# EAGLE schematic main (EAGLE 9.2.2)
Assembly variants: co

## Sheet 1 of 8: PSU
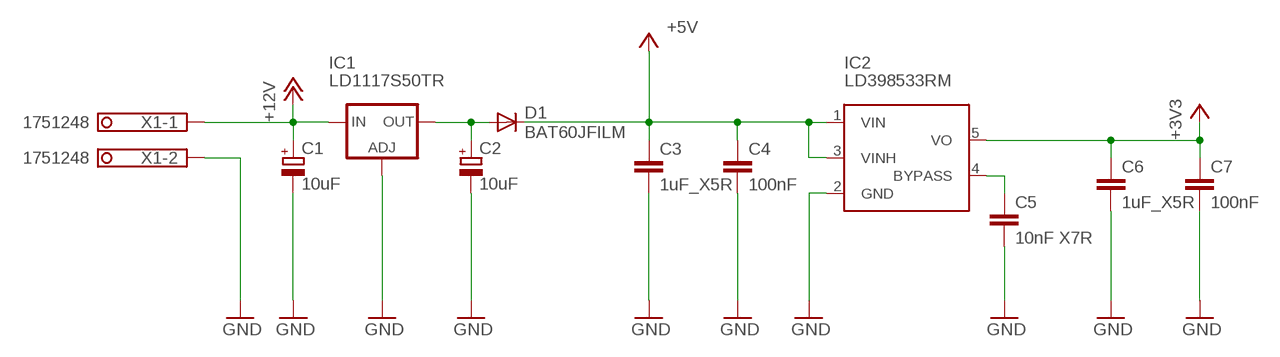
[diagram p0: schematic, sheet 1]

### Parts
C1  10uF  CPOL-EUSMCC  [SMC_C]
C2  10uF  CPOL-EUSMCC  [SMC_C]
C3  1uF_X5R  C-EUC0805  [C0805]
C4  100nF  C-EUC0805  [C0805]
C5  10nF X7R  C-EUC0805  [C0805]
C6  1uF_X5R  C-EUC0805  [C0805]
C7  100nF  C-EUC0805  [C0805]
D1  BAT60JFILM  DIODE-SOD323-W  [SOD323-W]
IC1  LD1117S50TR  LD117AS50TR  [SOT223]
IC2  LD398533RM  [SOT23-5L]
X1  1751248  [1751248]

### Nets
+3V3: C6.1 C7.1 IC2.5(VO) ; also sheet 2,3,4,5,6
+5V: C3.1 C4.1 D1.C IC2.1(VIN) IC2.3(VINH) ; also sheet 2,3,6
+12V [pwr]: C1.+ IC1.3(IN) X1.1 ; also sheet 7
GND [gnd]: C1.- C2.- C3.2 C4.2 C5.2 C6.2 C7.2 IC1.1(ADJ) IC2.2(GND) X1.2 ; also sheet 2,3,4,5,6,7
N$23: C2.+ D1.A IC1.4(OUT)
N$102: C5.1 IC2.4(BYPASS)

## Sheet 2 of 8: MCU
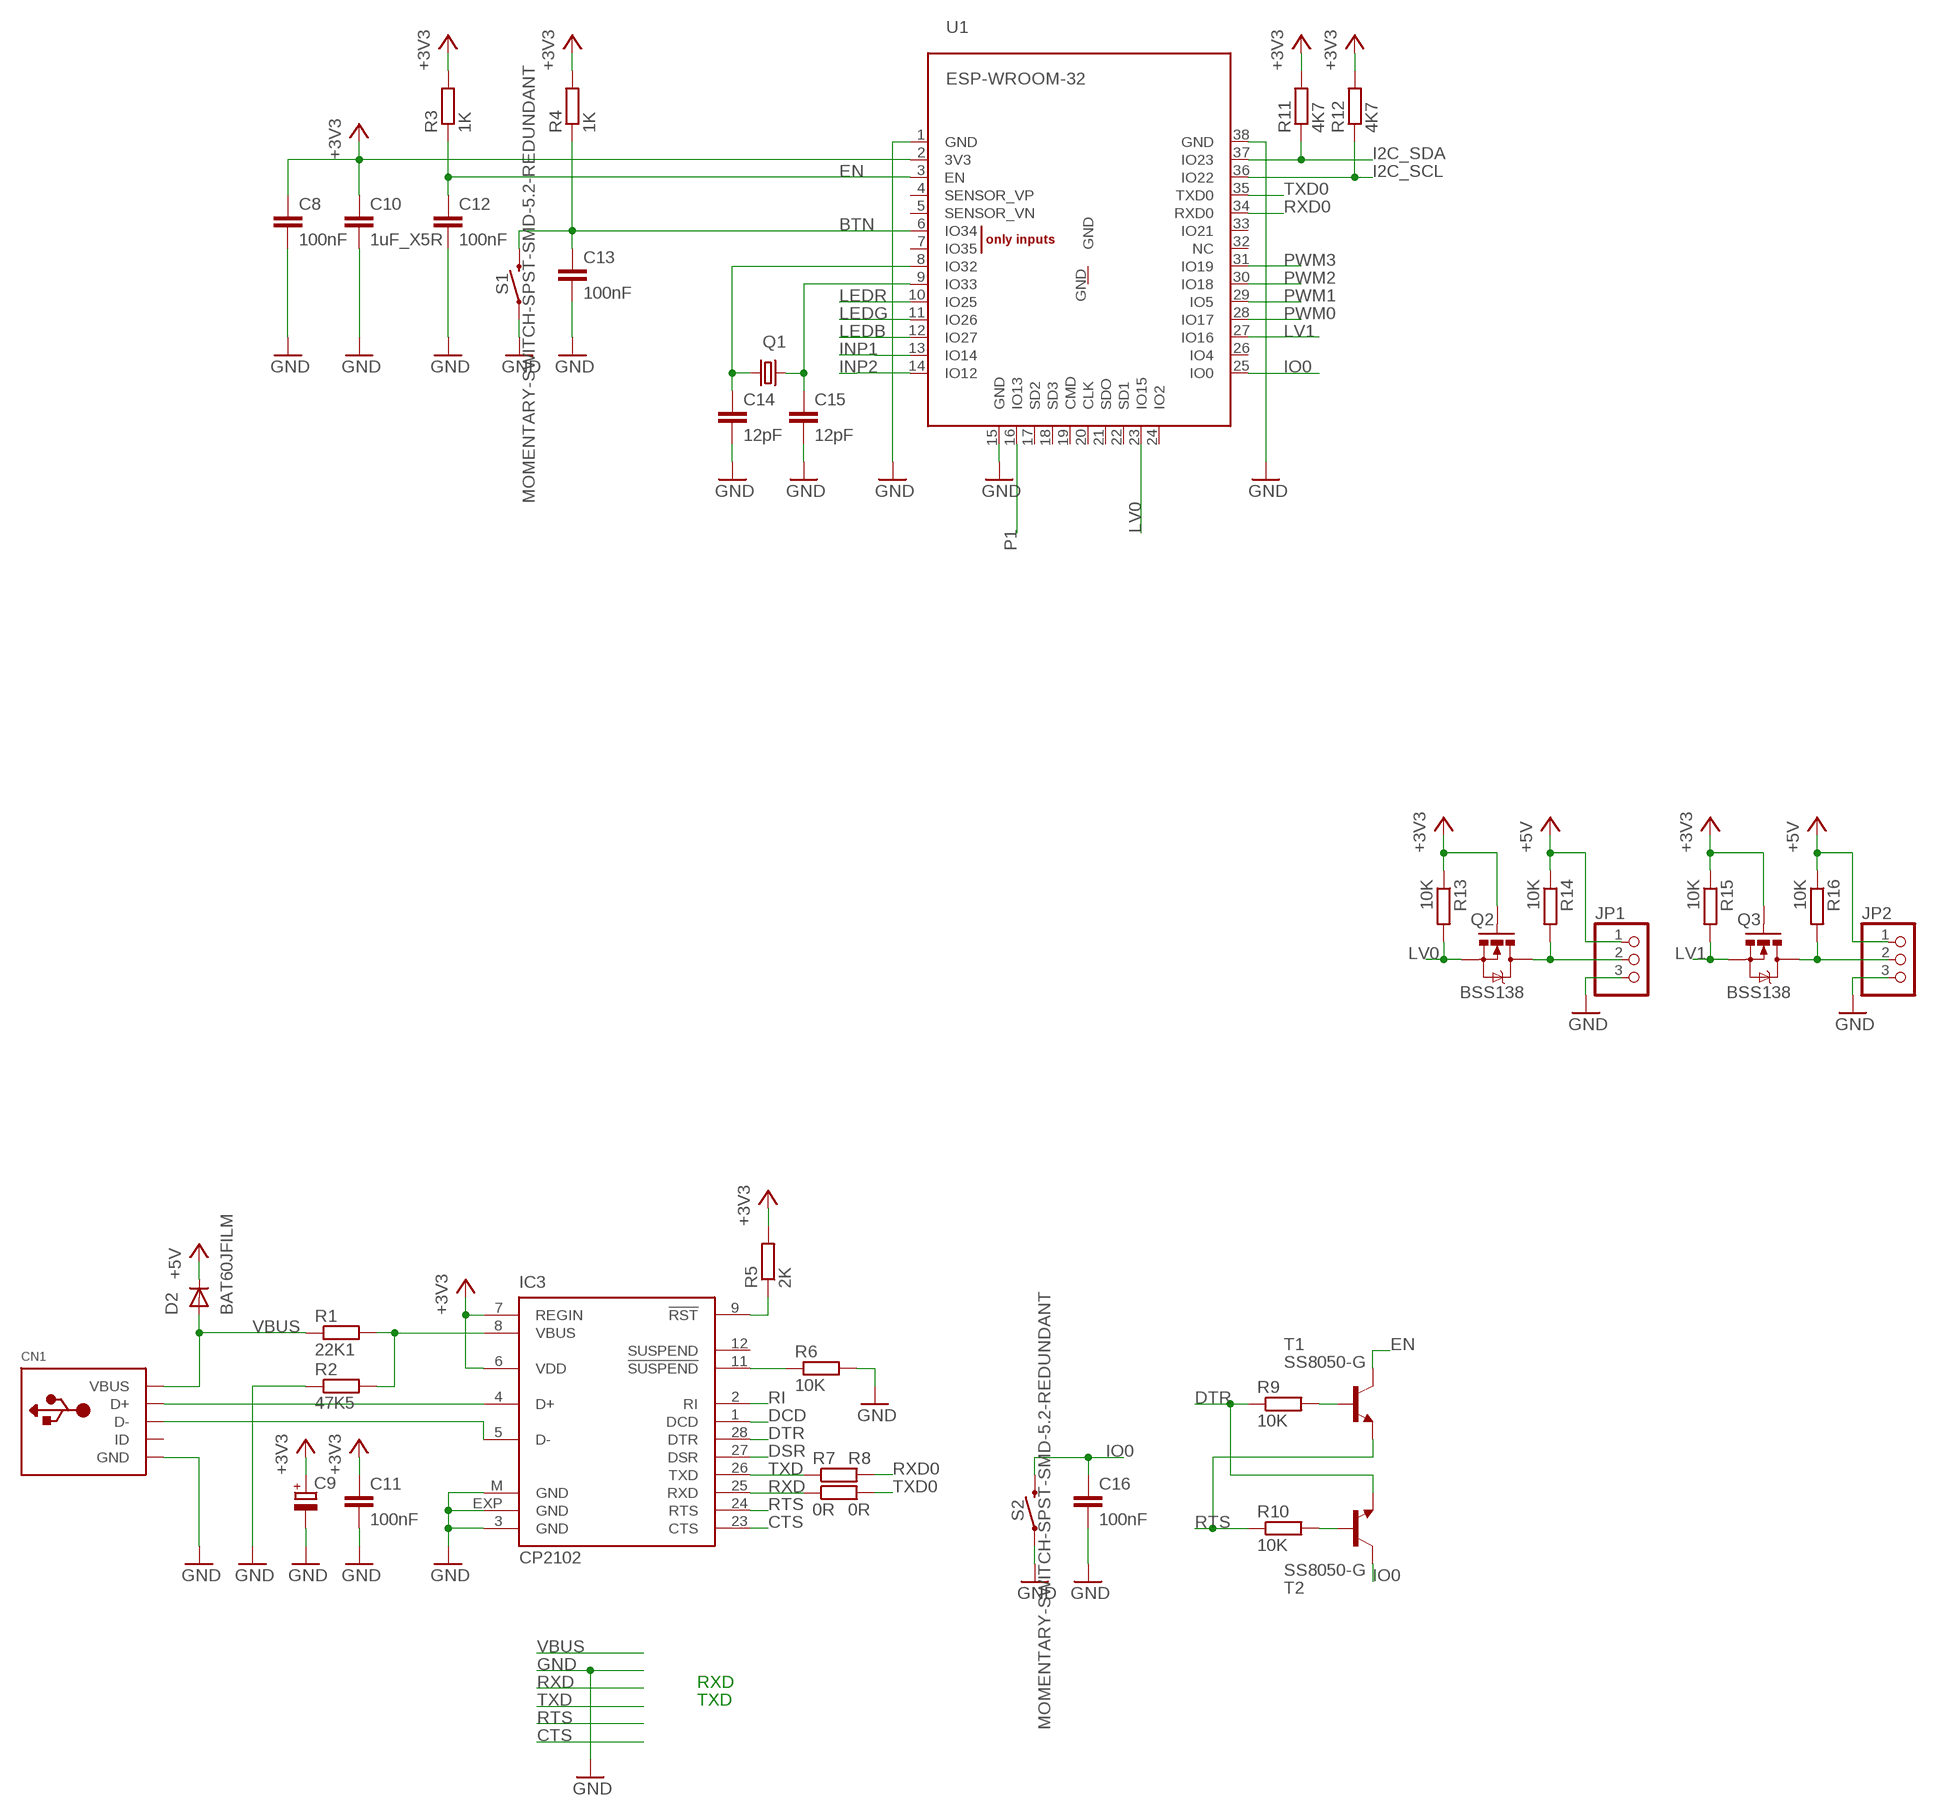
[diagram p1: schematic, sheet 2]

### Parts
C8  100nF  C-EUC0805  [C0805]
C9  CPOL-EUSMCA  [SMC_A]
C10  1uF_X5R  C-EUC0805  [C0805]
C11  100nF  C-EUC0805  [C0805]
C12  100nF  C-EUC0805  [C0805]
C13  100nF  C-EUC0805  [C0805]
C14  12pF  C-EUC0805  [C0805]
C15  12pF  C-EUC0805  [C0805]
C16  100nF  C-EUC0805  [C0805]
CN1  USBMINIB  [USB-MINIB]
D2  BAT60JFILM  DIODE-SOD323-W  [SOD323-W]
IC3  CP2102  [MLP28]
JP1  PINHD-1X3  [1X03]
JP2  PINHD-1X3  [1X03]
Q1  CRYSTALTC38H  [TC38H]
Q2  BSS138  MOSFET-NCHANNELSMD  [SOT23-3]
Q3  BSS138  MOSFET-NCHANNELSMD  [SOT23-3]
R1  22K1  R-EU_R0805  [R0805]
R2  47K5  R-EU_R0805  [R0805]
R3  1K  R-EU_R0805  [R0805]
R4  1K  R-EU_R0805  [R0805]
R5  2K  R-EU_R0805  [R0805]
R6  10K  R-EU_R0805  [R0805]
R7  0R  R-EU_R0805  [R0805]
R8  0R  R-EU_R0805  [R0805]
R9  10K  R-EU_R0805  [R0805]
R10  10K  R-EU_R0805  [R0805]
R11  4K7  R-EU_R0805  [R0805]
R12  4K7  R-EU_R0805  [R0805]
R13  10K  R-EU_R0805  [R0805]
R14  10K  R-EU_R0805  [R0805]
R15  10K  R-EU_R0805  [R0805]
R16  10K  R-EU_R0805  [R0805]
S1  MOMENTARY-SWITCH-SPST-SMD-5.2-REDUNDANT  [TACTILE_SWITCH_SMD_5.2MM]
S2  MOMENTARY-SWITCH-SPST-SMD-5.2-REDUNDANT  [TACTILE_SWITCH_SMD_5.2MM]
T1  SS8050-G  BCF29-NPN-SOT23-BEC  [SOT23-BEC]
T2  SS8050-G  BCF29-NPN-SOT23-BEC  [SOT23-BEC]
U1  ESP-WROOM-32  [ESP-WROOM-32]

### Nets
+3V3: C8.1 C9.+ C10.1 C11.1 IC3.6(VDD) IC3.7(REGIN) Q2.1(G) Q3.1(G) R3.2 R4.2 R5.2 R11.2 R12.2 R13.1 R15.1 U1.2(3V3) ; also sheet 1,3,4,5,6
+5V: D2.C JP1.1 JP2.1 R14.1 R16.1 ; also sheet 1,3,6
BTN: C13.1 R4.1 S1.3 S1.4 U1.6(IO34)
CTS: IC3.23(CTS)
DCD: IC3.1(DCD)
DSR: IC3.27(DSR)
DTR: IC3.28(DTR) R9.1 T2.E
EN: C12.1 R3.1 T1.C U1.3(EN)
GND [gnd]: C8.2 C9.- C10.2 C11.2 C12.2 C13.2 C14.2 C15.2 C16.2 CN1.GND IC3.3(GND) IC3.EXP(GND) IC3.M(GND) JP1.3 JP2.3 R2.1 R6.2 S1.1 S1.2 S2.1 S2.2 U1.1(GND) U1.15(GND) U1.38(GND) ; also sheet 1,3,4,5,6,7
HV1: JP1.2 Q2.3(D) R14.2
HV2: JP2.2 Q3.3(D) R16.2
I2C_SCL: R12.1 U1.36(IO22) ; also sheet 4
I2C_SDA: R11.1 U1.37(IO23) ; also sheet 4
INP1: U1.13(IO14) ; also sheet 3
INP2: U1.14(IO12) ; also sheet 3
IO0: C16.1 S2.3 S2.4 T2.C U1.25(IO0)
LEDB: U1.12(IO27) ; also sheet 5
LEDG: U1.11(IO26) ; also sheet 5
LEDR: U1.10(IO25) ; also sheet 5
LV0: Q2.2(S) R13.2 U1.23(IO15)
LV1: Q3.2(S) R15.2 U1.27(IO16)
N$6: CN1.D+ IC3.4(D+)
N$19: IC3.11(!SUSPEND) R6.1
N$21: IC3.9(!RST) R5.1
N$24: IC3.8(VBUS) R1.2 R2.2
N$25: CN1.D- IC3.5(D-)
N$38: C14.1 Q1.2 U1.8(IO32)
N$39: C15.1 Q1.1 U1.9(IO33)
N$42: R9.2 T1.B
N$43: R10.2 T2.B
P1: U1.16(IO13) ; also sheet 6
PWM0: U1.28(IO17) ; also sheet 7
PWM1: U1.29(IO5) ; also sheet 7
PWM2: U1.30(IO18) ; also sheet 7
PWM3: U1.31(IO19) ; also sheet 7
RI: IC3.2(RI)
RTS: IC3.24(RTS) R10.1 T1.E
RXD: IC3.25(RXD) R8.1
RXD0: R7.2 U1.34(RXD0)
TXD: IC3.26(TXD) R7.1
TXD0: R8.2 U1.35(TXD0)
VBUS: CN1.VBUS D2.A R1.1
Unconnected: CN1.ID IC3.12(SUSPEND) U1.4(SENSOR_VP) U1.5(SENSOR_VN) U1.7(IO35) U1.17(SD2) U1.18(SD3) U1.19(CMD) U1.20(CLK) U1.21(SDO) U1.22(SD1) U1.24(IO2) U1.26(IO4) U1.32(NC) U1.33(IO21) U1.GND

### Notes on the sheet
- RXD
- TXD

## Sheet 3 of 8: INPUTS
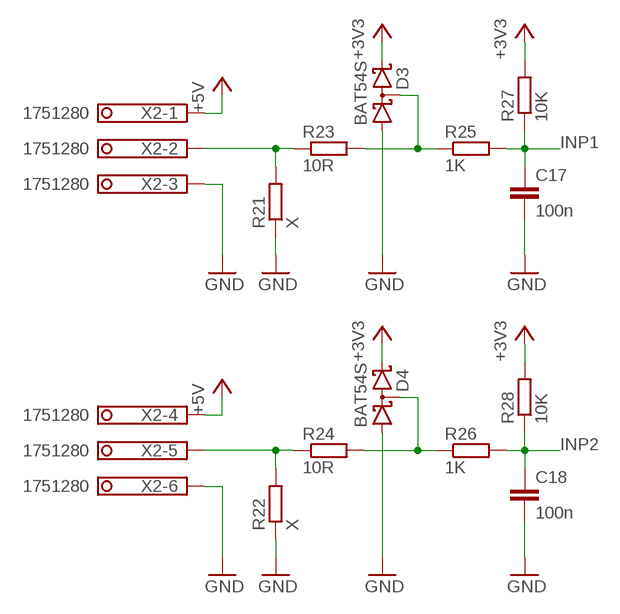
[diagram p2: schematic, sheet 3]

### Parts
C17  100n  C-EUC0805  [C0805]
C18  100n  C-EUC0805  [C0805]
D3  BAT54S  [SOT23]
D4  BAT54S  [SOT23]
R21  X  R-EU_R0805  [R0805]
R22  X  R-EU_R0805  [R0805]  (not fitted in variant co)
R23  10R  R-EU_R0805  [R0805]
R24  10R  R-EU_R0805  [R0805]
R25  1K  R-EU_R0805  [R0805]
R26  1K  R-EU_R0805  [R0805]
R27  10K  R-EU_R0805  [R0805]
R28  10K  R-EU_R0805  [R0805]
X2  1751280  [1751280]

### Nets
+3V3: D3.2(C2) D4.2(C2) R27.2 R28.2 ; also sheet 1,2,4,5,6
+5V: X2.1 X2.4 ; also sheet 1,2,6
GND [gnd]: C17.2 C18.2 D3.1(A1) D4.1(A1) R21.1 R22.1 X2.3 X2.6 ; also sheet 1,2,4,5,6,7
INP1: C17.1 R25.2 R27.1 ; also sheet 2
INP2: C18.1 R26.2 R28.1 ; also sheet 2
N$2: R22.2 R24.1 X2.5
N$3: D3.3(C1A2) R23.2 R25.1
N$8: D4.3(C1A2) R24.2 R26.1
N$20: R21.2 R23.1 X2.2

## Sheet 4 of 8: SENSOR
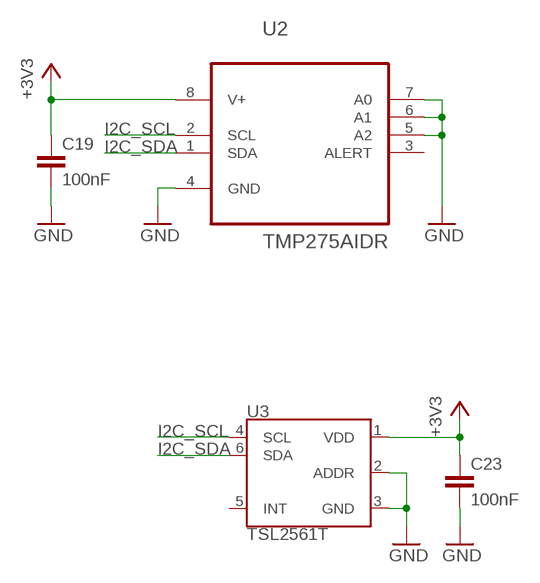
[diagram p3: schematic, sheet 4]

### Parts
C19  100nF  C-EUC0805  [C0805]
C23  100nF  C-EUC0805  [C0805]
U2  TMP275AIDR  [SOIC127P600X175-8N]
U3  TSL2561T  [TMB-6]

### Nets
+3V3: C19.1 C23.1 U2.8(V+) U3.1(VDD) ; also sheet 1,2,3,5,6
GND [gnd]: C19.2 C23.2 U2.4(GND) U2.5(A2) U2.6(A1) U2.7(A0) U3.2(ADDR) U3.3(GND) ; also sheet 1,2,3,5,6,7
I2C_SCL: U2.2(SCL) U3.4(SCL) ; also sheet 2
I2C_SDA: U2.1(SDA) U3.6(SDA) ; also sheet 2
Unconnected: U2.3(ALERT) U3.5(INT)

## Sheet 5 of 8: LED
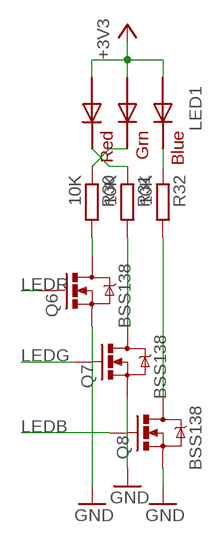
[diagram p4: schematic, sheet 5]

### Parts
LED1  RGBLED5050  [RGBLED5050]
Q6  BSS138  MOSFET-NCHANNELSMD  [SOT23-3]
Q7  BSS138  MOSFET-NCHANNELSMD  [SOT23-3]
Q8  BSS138  MOSFET-NCHANNELSMD  [SOT23-3]
R30  10K  R-EU_R0805  [R0805]
R31  10K  R-EU_R0805  [R0805]
R32  10K  R-EU_R0805  [R0805]

### Nets
+3V3: LED1.1(GREEN_A) LED1.2(RED_A) LED1.3(BLUE_A) ; also sheet 1,2,3,4,6
GND [gnd]: Q6.2(S) Q7.2(S) Q8.2(S) ; also sheet 1,2,3,4,6,7
LEDB: Q8.1(G) ; also sheet 2
LEDG: Q7.1(G) ; also sheet 2
LEDR: Q6.1(G) ; also sheet 2
N$1: Q6.3(D) R30.2
N$5: LED1.6(GREEN_C) R30.1
N$11: LED1.5(RED_C) R31.1
N$29: LED1.4(BLUE_C) R32.1
N$31: Q7.3(D) R31.2
N$32: Q8.3(D) R32.2

## Sheet 6 of 8: P1
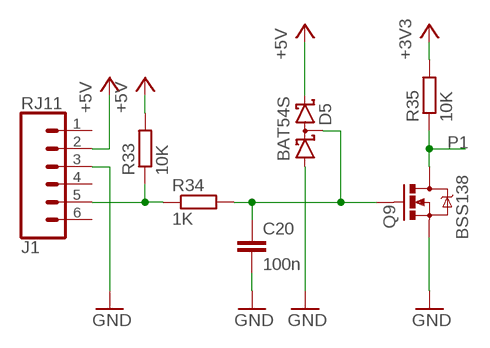
[diagram p5: schematic, sheet 6]

### Parts
C20  100n  C-EUC0805  [C0805]
D5  BAT54S  [SOT23]
J1  RJ11  RJ11-6  [RJ11-6]
Q9  BSS138  MOSFET-NCHANNELSMD  [SOT23-3]
R33  10K  R-EU_R0805  [R0805]
R34  1K  R-EU_R0805  [R0805]
R35  10K  R-EU_R0805  [R0805]

### Nets
+3V3: R35.2 ; also sheet 1,2,3,4,5
+5V: D5.2(C2) J1.2 R33.2 ; also sheet 1,2,3
GND [gnd]: C20.2 D5.1(A1) J1.3 Q9.2(S) ; also sheet 1,2,3,4,5,7
N$26: J1.5 R33.1 R34.1
N$27: C20.1 D5.3(C1A2) Q9.1(G) R34.2
P1: Q9.3(D) R35.1 ; also sheet 2
Unconnected: J1.1 J1.4 J1.6

## Sheet 7 of 8: OUTPUT-DRIVERS
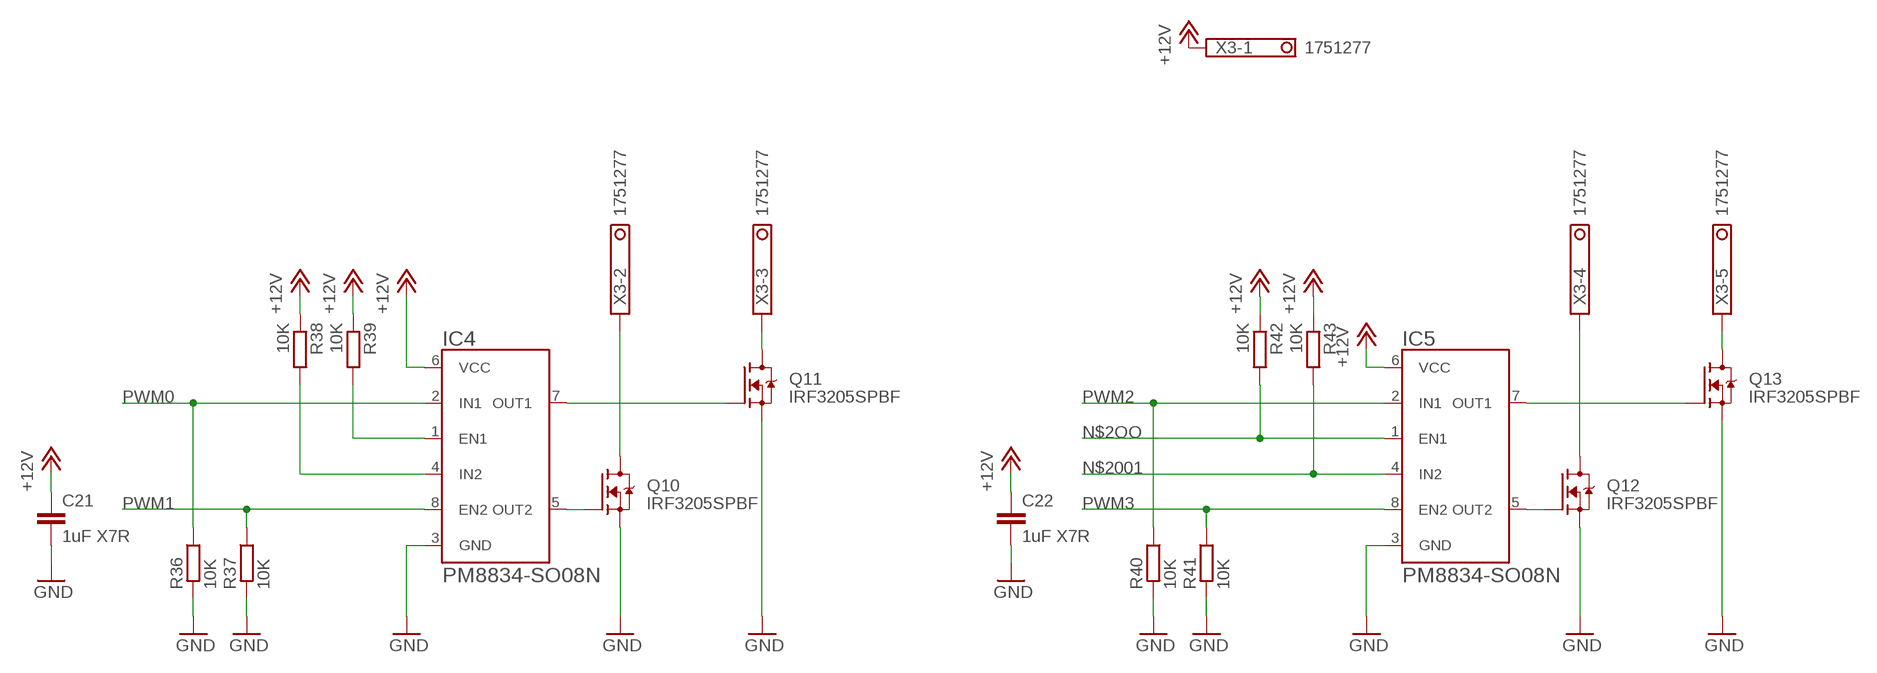
[diagram p6: schematic, sheet 7]

### Parts
C21  1uF X7R  C-EUC0805  [C0805]
C22  1uF X7R  C-EUC0805  [C0805]
IC4  PM8834-SO08N  [SO08N]
IC5  PM8834-SO08N  [SO08N]
Q10  IRF3205SPBF  [TRANS_IRF3205SPBF]
Q11  IRF3205SPBF  [TRANS_IRF3205SPBF]
Q12  IRF3205SPBF  [TRANS_IRF3205SPBF]
Q13  IRF3205SPBF  [TRANS_IRF3205SPBF]
R36  10K  R-EU_R0805  [R0805]
R37  10K  R-EU_R0805  [R0805]
R38  10K  R-EU_R0805  [R0805]
R39  10K  R-EU_R0805  [R0805]
R40  10K  R-EU_R0805  [R0805]
R41  10K  R-EU_R0805  [R0805]
R42  10K  R-EU_R0805  [R0805]
R43  10K  R-EU_R0805  [R0805]
X3  1751277  [1751277]

### Nets
+12V [pwr]: C21.1 C22.1 IC4.6(VCC) IC5.6(VCC) R38.2 R39.2 R42.2 R43.2 X3.1 ; also sheet 1
GND [gnd]: C21.2 C22.2 IC4.3(GND) IC5.3(GND) Q10.3(S) Q11.3(S) Q12.3(S) Q13.3(S) R36.2 R37.2 R40.2 R41.2 ; also sheet 1,2,3,4,5,6
N$2OO: IC5.1(EN1) R42.1
N$7 [pwr]: Q10.2(D) X3.2
N$9: IC4.1(EN1) R39.1
N$10: IC4.4(IN2) R38.1
N$12: IC4.7(OUT1) Q11.1(G)
N$13: IC4.5(OUT2) Q10.1(G)
N$14 [pwr]: Q11.2(D) X3.3
N$15: IC5.7(OUT1) Q13.1(G)
N$16: IC5.5(OUT2) Q12.1(G)
N$17 [pwr]: Q12.2(D) X3.4
N$18 [pwr]: Q13.2(D) X3.5
N$2001: IC5.4(IN2) R43.1
PWM0: IC4.2(IN1) R36.1 ; also sheet 2
PWM1: IC4.8(EN2) R37.1 ; also sheet 2
PWM2: IC5.2(IN1) R40.1 ; also sheet 2
PWM3: IC5.8(EN2) R41.1 ; also sheet 2

## Sheet 8 of 8: OUTLINE
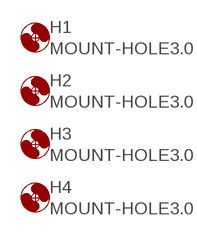
[diagram p7: schematic, sheet 8]

### Parts
H1  MOUNT-HOLE3.0  [3,0]
H2  MOUNT-HOLE3.0  [3,0]
H3  MOUNT-HOLE3.0  [3,0]
H4  MOUNT-HOLE3.0  [3,0]

## Library data of the parts
C1 C2 C9 = resistor:CPOL-EU: POLARIZED CAPACITOR, European symbol
C3-C8 C10-C23 = resistor:C-EU: CAPACITOR, European symbol
CN1 = adafruit:USB: USB Connectors USBMINIB - Surface Mount Female Mini-B USB Connector 4UConnector: 06564 By microbuilder.eu Thru-hole RA Female Mini-B USB Connector 4UConnector: 18732 By ladyada.net
D1 D2 = diode:DIODE-: DIODE
D3-D5 = diode:BAT54S: Schottky Diodes Pin connection corrected 2011-05-04 Source: Fairchild .. BAT54.pdf
H1-H4 = holes:MOUNT-HOLE: MOUNTING HOLE with drill center marker
IC1 = v-reg:LD117A?*: Low drop fixed and adjustable positive voltage regulators 1 A Source: http://www.st.com/stonline/products/literature/ds/7194/ld1117axx.pdf
IC2 = st-microelectronics:LD3985: Ultra low drop and low noise BiCMOS voltage regulators Source: www.st.com LD3985.pdf
IC3 = silabs:CP210*: Single-Chip USB to UART Bridge Source: www.silabs.com .. CP2101.pdf / cp2102.pdf; MF: FARNELL; MPN: CP2102-GM; OC_FARNELL: 9282130; OC_NEWARK: 30K5635
IC4 IC5 = PM8834:PM8834: ST - PM8834 4A Dual, LowSide, PWM MOSFET Driver. http://www.st.com/stonline/products/literature/ds/15086/pm8834.pdf; AVAILABILITY: Unavailable; DESCRIPTION: PM8834 Series 18 V 4 A 1.3 Ohm SMT Dual Low Side MOSFET Driver - SOIC-8; MF: STMicroelectronics; MP: PM8834; PACKAGE: SOIC-8 STMicroelectronics; PRICE: None
J1 = SparkFun-Connectors:RJ11-6: RJ11 Jack - 6 pin Commonly found on CAT3 devices and some Microchip programmers. Here is the connector we sell at SparkFun: RJ11 6-Pin Connector <https://www.sparkfun.com/products/132> (PRT-00132) Datasheet <http://www.sparkfun.com/datasheets/Prototyping/Connectors/RJ11-Datasheet.pdf> It is used on this SparkFun product: SparkFun Weather Shield <https://www.sparkfun.com/products/12081> (DEV-12081) Weather Meters <https://www.sparkfun.com/products/8942> (SEN-08942); PROD_ID: CONN-08590; SF_ID: PRT-00132
JP1 JP2 = adafruit:PINHD-1X3: PIN HEADER
LED1 = adafruit:RGBLED: For 5050 RGB LEDs, the order of the LEDs may vary from one manufacturer to another!
Q1 = crystal:CRYSTAL: CRYSTAL; OC_FARNELL: unknown; OC_NEWARK: unknown
Q2 Q3 Q6-Q9 = SparkFun:MOSFET-NCHANNEL
Q10-Q13 = IRF3205SPBF:IRF3205SPBF: Single N-Channel 55 V 200 W 146 nC Hexfet Power Mosfet Surface Mount - D2PAK-3; AVAILABILITY: Unavailable; DESCRIPTION: Single N-Channel 55 V 200 W 146 nC Hexfet Power Mosfet Surface Mount - D2PAK-3; MF: Infineon Technologies; MP: IRF3205SPBF; PACKAGE: D2PAK Infineon; PRICE: None
R1-R16 R21-R28 R30-R43 = resistor:R-EU_: RESISTOR, European symbol
S1 S2 = SparkFun-Switches:MOMENTARY-SWITCH-SPST: Momentary Switch (Pushbutton) - SPST Normally-open (NO) SPST momentary switches (buttons, pushbuttons). Variants PTH-12MM - 12mm square, through-hole Momentary Pushbutton Switch - 12mm Square <https://www.sparkfun.com/products/9190> (COM-09190) PTH-6.0MM, PTH-6.0MM-KIT - 6.0mm square, through-hole Mini Pushbutton Switch <https://www.sparkfun.com/products/97> (COM-00097) KIT package intended for soldering kit's - only one side of pads' copper is exposed. PTH-RIGHT-ANGLE-KIT - Right-angle, through-hole Right Angle Tactile Button <https://www.sparkfun.com/products/10791> - Used on SparkFun BigTime Watch Kit <https://www.sparkfun.com/products/11734> SMD-12MM - 12mm square, surface-mount Tactile Button - SMD (12mm) <https://www.sparkfun.com/products/12993> (COM-12993) Used on SparkFun PicoBoard <https://www.sparkfun.com/products/11888> SMD-4.5MM - 4.5mm Square Trackball Switch Used on SparkFun Blackberry Trackballer Breakout <https://www.sparkfun.com/products/13169> SMD-4.6MMX2.8MM - 4.60mm x 2.80mm, surface mount Used on SparkFun SAMD21 Mini Breakout <https://www.sparkfun.com/products/13664> SMD-5.2MM, SMD-5.2-REDUNDANT - 5.2mm square, surface-mount Mini Pushbutton Switch - SMD <https://www.sparkfun.com/products/8720> (COM-08720) Used on Arduino Pro Mini <https://www.sparkfun.com/products/11114> REDUNDANT package connects both switch circuits together SMD-6.0X3.5MM - 6.0 x 3.5mm, surface mount Momentary Reset Switch SMD <https://www.sparkfun.com/products/8229> (COM-08229) SMD-6.2MM-TALL - 6.2mm square, surface mount Tactile Button - SMD (6mm) <https://www.sparkfun.com/products/12992> Used on SparkFun Digital Sandbox <https://www.sparkfun.com/products/12651> SMD-RIGHT-ANGLE - Right-angle, surface mount Used on SparkFun Block for Intel® Edison - Arduino <https://www.sparkfun.com/products/13036>; PROD_ID: SWCH-08247; SF_SKU: COM-08720
T1 T2 = transistor:*-NPN-: NPN Transistror BF959 corrected 2008.03.06
U1 = esp32:ESP-WROOM-32
U2 = TMP275AIDR:TMP275AIDR: 0.5°C Digital Out Temperature Sensor; AVAILABILITY: Unavailable; DESCRIPTION: ?0.5?C _max_ Temperature Sensor with I2C/SMBus Interface in Industry Standard LM75 Form Factor & Pin 8-SOIC -40 to 125; MF: Texas Instruments; MP: TMP275AIDR; PACKAGE: SOIC-8 Texas Instruments; PRICE: None
U3 = SparkFun-Sensors:TSL2561: TAOS TSL2561 Digital Luminosity (Light) Sensor The TSL2561 is a light-to-digital converter that transform light intensity to a digital signal output via I2C interface. The device combines one broadband photodiode (visible plus infrared) and one infrared-responding photodiode on a single CMOS integrated circuit capable of providing a near-photopic response over an effective 20-bit dynamic range (16-bit resolution). Two integrating ADCs convert the photodiode currents to a digital output that represents the irradiance measured on each channel. This digital output can be input to a microprocessor where illuminance (ambient light level) in lux is derived using an empirical formula to approximate the human eye response. The TSL2561 device supports a traditional level style interrupt that remains asserted until the firmware clears it. Datasheet <http://www.mouser.com/ds/2/588/ams_sl2560-e58-488842.pdf> SparkFun Products SparkFun Luminosity Sensor Breakout - TSL2561 <https://www.sparkfun.com/products/12055> (SEN-12055)
X1 = con-phoenix-350:1751248: MKDS 1/ 2-3,5 Printklemme Nennstrom: 10 A Bemessungsspannung: 160 V Raster: 3,5 mm Polzahl: 2 Montageart: Löten Anschlussart: Schraubanschluss Anschlussrichtung vom Leiter zur Platine: 0° Source: http://eshop.phoenixcontact.com .. 1751248.pdf; OC_FARNELL: unknown; OC_NEWARK: unknown
X2 = con-phoenix-350:1751280: MKDS 1/ 6-3,5 Printklemme Nennstrom: 10 A Bemessungsspannung: 160 V Raster: 3,5 mm Polzahl: 6 Montageart: Löten Anschlussart: Schraubanschluss Anschlussrichtung vom Leiter zur Platine: 0° Source: http://eshop.phoenixcontact.com .. 1751280.pdf; MPN: 1751280; OC_FARNELL: unknown; OC_NEWARK: 27R1765
X3 = con-phoenix-350:1751277: MKDS 1/ 5-3,5 Printklemme Nennstrom: 10 A Bemessungsspannung: 160 V Raster: 3,5 mm Polzahl: 5 Montageart: Löten Anschlussart: Schraubanschluss Anschlussrichtung vom Leiter zur Platine: 0° Source: http://eshop.phoenixcontact.com .. 1751277.pdf; OC_FARNELL: unknown; OC_NEWARK: unknown

## Net classes
0 default: width 0.305 mm
1 pwr: width 0.305 mm
2 gnd: width 0.305 mm, drill 0.559 mm, clearance 0.152 mm